# Altium schematic sheet key_pad.SchDoc
size A3; SheetNumber: 2; SheetTotal: 2
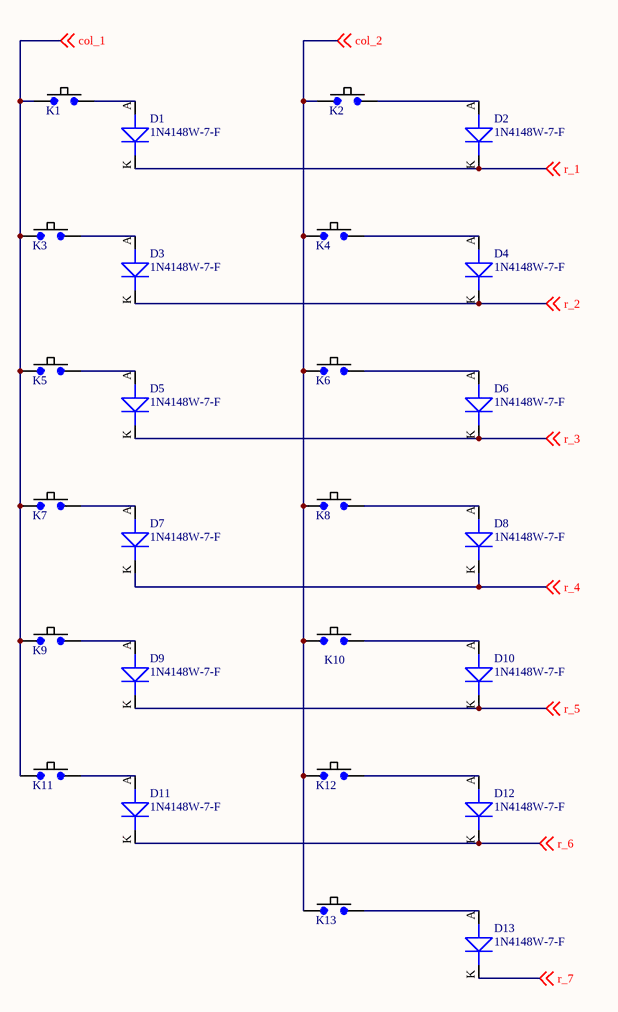
[diagram p0: key_pad.SchDoc]

## Parts
D1  1N4148W-7-F  [DIO_SOD-123]
D2  1N4148W-7-F  [DIO_SOD-123]
D3  1N4148W-7-F  [DIO_SOD-123]
D4  1N4148W-7-F  [DIO_SOD-123]
D5  1N4148W-7-F  [DIO_SOD-123]
D6  1N4148W-7-F  [DIO_SOD-123]
D7  1N4148W-7-F  [DIO_SOD-123]
D8  1N4148W-7-F  [DIO_SOD-123]
D9  1N4148W-7-F  [DIO_SOD-123]
D10  1N4148W-7-F  [DIO_SOD-123]
D11  1N4148W-7-F  [DIO_SOD-123]
D12  1N4148W-7-F  [DIO_SOD-123]
D13  1N4148W-7-F  [DIO_SOD-123]
K1  KEY PAD  [KEYPAD]  (value not drawn)
K2  KEY PAD  [KEYPAD]  (value not drawn)
K3  KEY PAD  [KEYPAD]  (value not drawn)
K4  KEY PAD  [KEYPAD]  (value not drawn)
K5  KEY PAD  [KEYPAD]  (value not drawn)
K6  KEY PAD  [KEYPAD]  (value not drawn)
K7  KEY PAD  [KEYPAD]  (value not drawn)
K8  KEY PAD  [KEYPAD]  (value not drawn)
K9  KEY PAD  [KEYPAD]  (value not drawn)
K10  KEY PAD  [KEYPAD]  (value not drawn)
K11  KEY PAD  [KEYPAD]  (value not drawn)
K12  KEY PAD  [KEYPAD]  (value not drawn)
K13  KEY PAD  [KEYPAD]  (value not drawn)

## Nets
col_1: K1.1 K3.1 K5.1 K7.1 K9.1 K11.1 ; off-sheet col_1
col_2: K2.1 K4.1 K6.1 K8.1 K10.1 K12.1 K13.1 ; off-sheet col_2
r_1: D1.K(CATHODE) D2.K(CATHODE) ; off-sheet r_1
r_2: D3.K(CATHODE) D4.K(CATHODE) ; off-sheet r_2
r_3: D5.K(CATHODE) D6.K(CATHODE) ; off-sheet r_3
r_4: D7.K(CATHODE) D8.K(CATHODE) ; off-sheet r_4
r_5: D9.K(CATHODE) D10.K(CATHODE) ; off-sheet r_5
r_6: D11.K(CATHODE) D12.K(CATHODE) ; off-sheet r_6
r_7: D13.K(CATHODE) ; off-sheet r_7
NetD1_A: D1.A(ANODE) K1.2
NetD2_A: D2.A(ANODE) K2.2
NetD3_A: D3.A(ANODE) K3.2
NetD4_A: D4.A(ANODE) K4.2
NetD5_A: D5.A(ANODE) K5.2
NetD6_A: D6.A(ANODE) K6.2
NetD7_A: D7.A(ANODE) K7.2
NetD8_A: D8.A(ANODE) K8.2
NetD9_A: D9.A(ANODE) K9.2
NetD10_A: D10.A(ANODE) K10.2
NetD11_A: D11.A(ANODE) K11.2
NetD12_A: D12.A(ANODE) K12.2
NetD13_A: D13.A(ANODE) K13.2

## Library data of the parts
D1-D13 = DIO_100V-300mA-SOD123: Diode Standard 100V 300mA (DC) Surface Mount SOD-123; Manufacturer: FAIRCHILD; Alternate Part Number-1: NA; Manufacturer Part Number: 1N4148W-7-F; Case/Package: SOD123; Supplier-1: SIRICOM; Supplier Part Number-1: 1N4148W-7-F